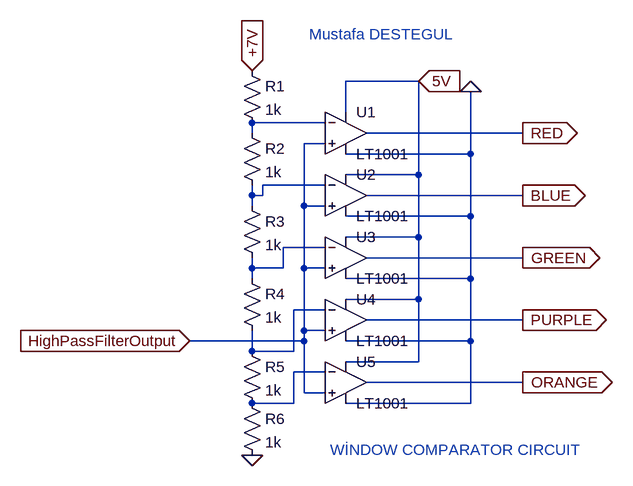
[diagram p0: schematic window.asc]
window.asc, the LTspice schematic file:
Version 4
SHEET 1 1076 680
WIRE 336 -48 224 -48
WIRE 224 0 224 -48
WIRE 192 16 80 16
WIRE 80 32 80 16
WIRE 496 32 256 32
WIRE 192 48 160 48
WIRE 416 64 416 -32
WIRE 416 64 224 64
WIRE 336 96 336 -48
WIRE 336 96 224 96
WIRE 192 112 96 112
WIRE 80 128 80 112
WIRE 96 128 96 112
WIRE 96 128 80 128
WIRE 496 128 256 128
WIRE 80 144 80 128
WIRE 160 144 160 48
WIRE 192 144 160 144
WIRE 416 160 416 64
WIRE 416 160 224 160
WIRE 336 192 336 96
WIRE 336 192 224 192
WIRE 192 208 128 208
WIRE 496 224 256 224
WIRE 80 240 80 224
WIRE 128 240 128 208
WIRE 128 240 80 240
WIRE 160 240 160 144
WIRE 192 240 160 240
WIRE 80 256 80 240
WIRE 416 256 416 160
WIRE 416 256 224 256
WIRE 336 288 336 192
WIRE 336 288 224 288
WIRE 192 304 144 304
WIRE 496 320 256 320
WIRE 160 336 160 240
WIRE 192 336 160 336
WIRE 160 352 160 336
WIRE 160 352 -16 352
WIRE 416 352 416 256
WIRE 416 352 224 352
WIRE 80 368 80 336
WIRE 144 368 144 304
WIRE 144 368 80 368
WIRE 336 384 336 288
WIRE 336 384 224 384
WIRE 192 400 144 400
WIRE 496 416 256 416
WIRE 160 432 160 352
WIRE 192 432 160 432
WIRE 144 448 144 400
WIRE 144 448 80 448
WIRE 416 448 416 352
WIRE 416 448 224 448
FLAG -16 352 HighPassFilterOutput
IOPIN -16 352 In
FLAG 80 -64 +7V
IOPIN 80 -64 In
FLAG 80 528 0
FLAG 416 -32 0
IOPIN 416 -32 In
FLAG 336 -48 5V
IOPIN 336 -48 In
FLAG 496 32 RED
IOPIN 496 32 Out
FLAG 496 224 GREEN
IOPIN 496 224 Out
FLAG 496 128 BLUE
IOPIN 496 128 Out
FLAG 496 416 ORANGE
IOPIN 496 416 Out
FLAG 496 320 PURPLE
IOPIN 496 320 Out
SYMBOL Opamps\\LT1001 224 -32 R0
SYMATTR InstName U1
SYMBOL Opamps\\LT1001 224 64 R0
SYMATTR InstName U2
SYMBOL Opamps\\LT1001 224 160 R0
SYMATTR InstName U3
SYMBOL Opamps\\LT1001 224 256 R0
SYMATTR InstName U4
SYMBOL Opamps\\LT1001 224 352 R0
SYMATTR InstName U5
SYMBOL res 64 -80 R0
SYMATTR InstName R1
SYMATTR Value 1k
SYMBOL res 64 16 R0
SYMATTR InstName R2
SYMATTR Value 1k
SYMBOL res 64 128 R0
SYMATTR InstName R3
SYMATTR Value 1k
SYMBOL res 64 240 R0
SYMATTR InstName R4
SYMATTR Value 1k
SYMBOL res 64 352 R0
SYMATTR InstName R5
SYMATTR Value 1k
SYMBOL res 64 432 R0
SYMATTR InstName R6
SYMATTR Value 1k
TEXT 200 520 Left 2 ;WİNDOW COMPARATOR CIRCUIT
TEXT 168 -120 Left 2 ;Mustafa DESTEGUL

The netlist it stands for:
* window.asc
XU1 HighPassFilterOutput N001 5V 0 RED LT1001  ; pins In+ In- V+ V- OUT
XU2 HighPassFilterOutput N002 5V 0 BLUE LT1001  ; pins In+ In- V+ V- OUT
XU3 HighPassFilterOutput N003 5V 0 GREEN LT1001  ; pins In+ In- V+ V- OUT
XU4 HighPassFilterOutput N004 5V 0 PURPLE LT1001  ; pins In+ In- V+ V- OUT
XU5 HighPassFilterOutput N005 5V 0 ORANGE LT1001  ; pins In+ In- V+ V- OUT
R1 +7V N001 1k
R2 N001 N002 1k
R3 N002 N003 1k
R4 N003 N004 1k
R5 N004 N005 1k
R6 N005 0 1k
* WİNDOW COMPARATOR CIRCUIT
* Mustafa DESTEGUL
.lib LTC.lib
.backanno
.end